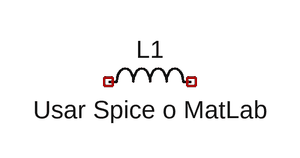
[diagram p0: schematic Inverter.asc]
Inverter.asc, the LTspice schematic file:
Version 4
SHEET 1 880 680
SYMBOL ind 144 160 R270
WINDOW 0 32 56 VTop 2
WINDOW 3 5 56 VBottom 2
SYMATTR InstName L1
SYMATTR Value Usar Spice o MatLab

The netlist it stands for:
* Inverter.asc
L1 NC_01 NC_02 Usar Spice o MatLab
.backanno
.end